# Altium schematic sheet pressure_sensor.SchDoc
size 431 x 279 mm; Author: Shivam Sharma; SheetNumber: 14; SheetTotal: 14
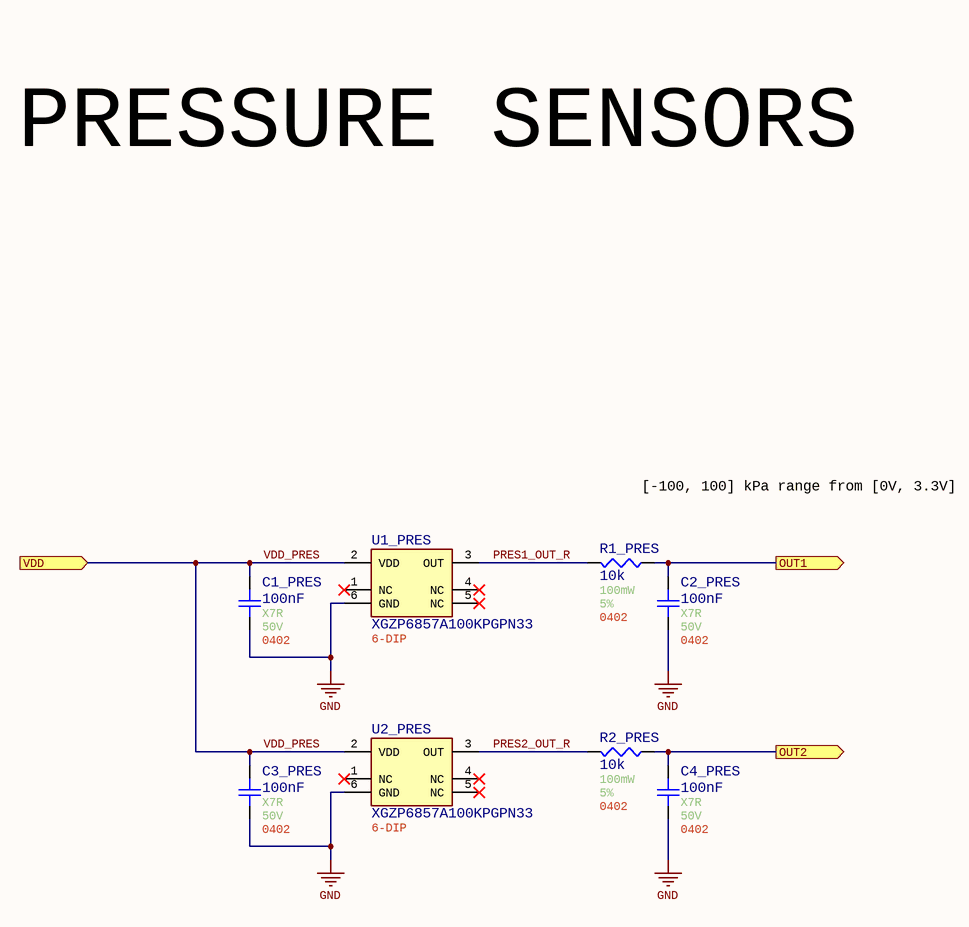
[diagram p0: pressure_sensor.SchDoc]

## Parts
C1_PRES  value 100nF  Temperature Coefficient: X7R  Voltage Rating: 50V  Case/Package: 0402  [Generic 0402 capacitor]  (hidden comment: GRT155R71H104KE01D)
C2_PRES  value 100nF  Temperature Coefficient: X7R  Voltage Rating: 50V  Case/Package: 0402  [Generic 0402 capacitor]  (hidden comment: GRT155R71H104KE01D)
C3_PRES  value 100nF  Temperature Coefficient: X7R  Voltage Rating: 50V  Case/Package: 0402  [Generic 0402 capacitor]  (hidden comment: GRT155R71H104KE01D)
C4_PRES  value 100nF  Temperature Coefficient: X7R  Voltage Rating: 50V  Case/Package: 0402  [Generic 0402 capacitor]  (hidden comment: GRT155R71H104KE01D)
R1_PRES  value 10k  Power: 100mW  Tolerance: 5%  Case/Package: 0402  [Generic 0402 Resistor]  (hidden comment: ERJ-2GEJ103X)
R2_PRES  value 10k  Power: 100mW  Tolerance: 5%  Case/Package: 0402  [Generic 0402 Resistor]  (hidden comment: ERJ-2GEJ103X)
U1_PRES  XGZP6857A100KPGPN33  Case/Package: 6-DIP  [6-DIP_XGZP6857]
U2_PRES  XGZP6857A100KPGPN33  Case/Package: 6-DIP  [6-DIP_XGZP6857]

## Ports
OUT1 (out), OUT2 (out), VDD (in)

## Nets
GND: C1_PRES.1 C2_PRES.1 C3_PRES.1 C4_PRES.1 U1_PRES.6(GND) U2_PRES.6(GND)
OUT1: C2_PRES.2 R1_PRES.1 ; port OUT1
OUT2: C4_PRES.2 R2_PRES.1 ; port OUT2
PRES1_OUT_R: R1_PRES.2 U1_PRES.3(OUT)
PRES2_OUT_R: R2_PRES.2 U2_PRES.3(OUT)
VDD_PRES: C1_PRES.2 C3_PRES.2 U1_PRES.2(VDD) U2_PRES.2(VDD) ; port VDD

Not connected (* = marked no-connect by the designer): U1_PRES 1(NC)* 4(NC)* 5(NC)*; U2_PRES 1(NC)* 4(NC)* 5(NC)*

## Notes on the sheet
- PRESSURE SENSORS
- [-100, 100] kPa range from [0V, 3.3V]
- Title:
- Author:
- Approved:
- Size:
- Date:
- Git Hash:
- Sch Revision:
- B
- Prj:
- SCH PN:
- Variant:
- Edited:
- CONFIDENTIAL
- File:

## Library data of the parts
C1_PRES C2_PRES C3_PRES C4_PRES = CMP-001-00084-12: Ceramic Capacitor, Multilayer, Ceramic, 50V, 10% +Tol, 10% -Tol, X7R, 15% TC, 0.1uF, Surface Mount, 0402; Multilayer: Yes; Terminal Finish: Nickel; Capacitor Type: Ceramic; Package Shape: Rectangular; Reach SVHC Compliant: Yes; Max Operating Temperature: 125°C; RoHS Compliant: Yes; Termination: Wraparound; Packaging: Tape and Reel; AECQ: Yes; Pins: 2; Dielectric Material: Ceramic; Min Operating Temperature: -55°C; Tolerance: 10%; Mounting Technology: Surface Mount
R1_PRES R2_PRES = CMP-009-00185-9: Res Thick Film 0402 10K Ohm 5% 1/10W ±200ppm/°C Molded SMD Punched Carrier T/R; AECQ: No; Mounting Technology: Surface Mount; Max Operating Temperature: 155°C; Min Operating Temperature: -55°C; RoHS Compliant: Yes; Pins: 2
U1_PRES U2_PRES = CMP-010-00049-1: Pressure Sensor 14.5PSI(-100 - 100)kPa; Sensor Type: Barometric Pressure; Nominal Supply Voltage: 3.3V; Max Operating Temperature: 100°C; Pins: 6; Min Operating Temperature: -20°C; Mounting Technology: SMD